# Altium schematic sheet Sheet_1_2021-12-13.schdoc
size 48 x 29 mm
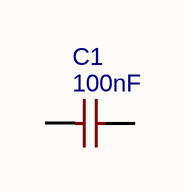
[diagram p0: Sheet_1_2021-12-13.schdoc]

## Parts
C1  100nF  [C0402_NEW]

## Nets

Not connected (* = marked no-connect by the designer): C1 1 2

## Library data of the parts
C1 = 100nF: BOM_Manufacturer Part: CL05B104KO5NNNC; BOM_Manufacturer: SAMSUNG; nameAlias: Capacitance; BOM_Supplier: LCSC; BOM_Supplier Part: C1525; BOM_JLCPCB Part Class: Basic Part; spicePre: C; spiceSymbolName: CL05B104KO5NNNC